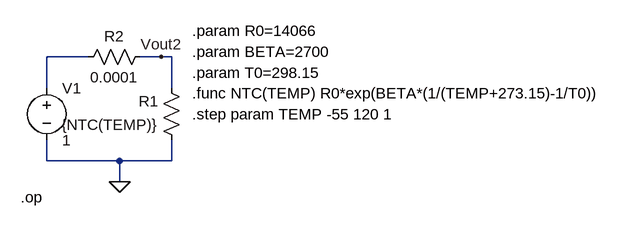
[diagram p0: schematic ACTIVIDAD4-NTC.asc]
ACTIVIDAD4-NTC.asc, the LTspice schematic file:
Version 4.1
SHEET 1 880 680
WIRE -160 32 -224 32
WIRE -48 32 -80 32
WIRE -32 32 -48 32
WIRE -224 80 -224 32
WIRE -32 80 -32 32
WIRE -224 192 -224 160
WIRE -112 192 -224 192
WIRE -32 192 -32 160
WIRE -32 192 -112 192
WIRE -112 224 -112 192
FLAG -48 32 Vout2
FLAG -112 224 0
SYMBOL res -16 176 R180
WINDOW 0 36 76 Left 2
WINDOW 3 36 40 Left 2
SYMATTR InstName R1
SYMATTR Value {NTC(TEMP)}
SYMBOL voltage -224 64 R0
WINDOW 123 0 0 Left 0
WINDOW 39 0 0 Left 0
SYMATTR InstName V1
SYMATTR Value 1
SYMBOL res -64 16 R90
WINDOW 0 0 56 VBottom 2
WINDOW 3 32 56 VTop 2
SYMATTR InstName R2
SYMATTR Value 0.0001
TEXT 0 88 Left 2 !.func NTC(TEMP) R0*exp(BETA*(1/(TEMP+273.15)-1/T0))
TEXT 0 120 Left 2 !.step param TEMP -55 120 1
TEXT 0 -8 Left 2 !.param R0=14066
TEXT 0 24 Left 2 !.param BETA=2700
TEXT 0 56 Left 2 !.param T0=298.15
TEXT -264 248 Left 2 !.op

The netlist it stands for:
* ACTIVIDAD4-NTC.asc
R1 0 Vout2 {NTC(TEMP)}
V1 N001 0 1
R2 Vout2 N001 0.0001
.func NTC(TEMP) R0*exp(BETA*(1/(TEMP+273.15)-1/T0))
.step param TEMP -55 120 1
.param R0=14066
.param BETA=2700
.param T0=298.15
.op
.backanno
.end